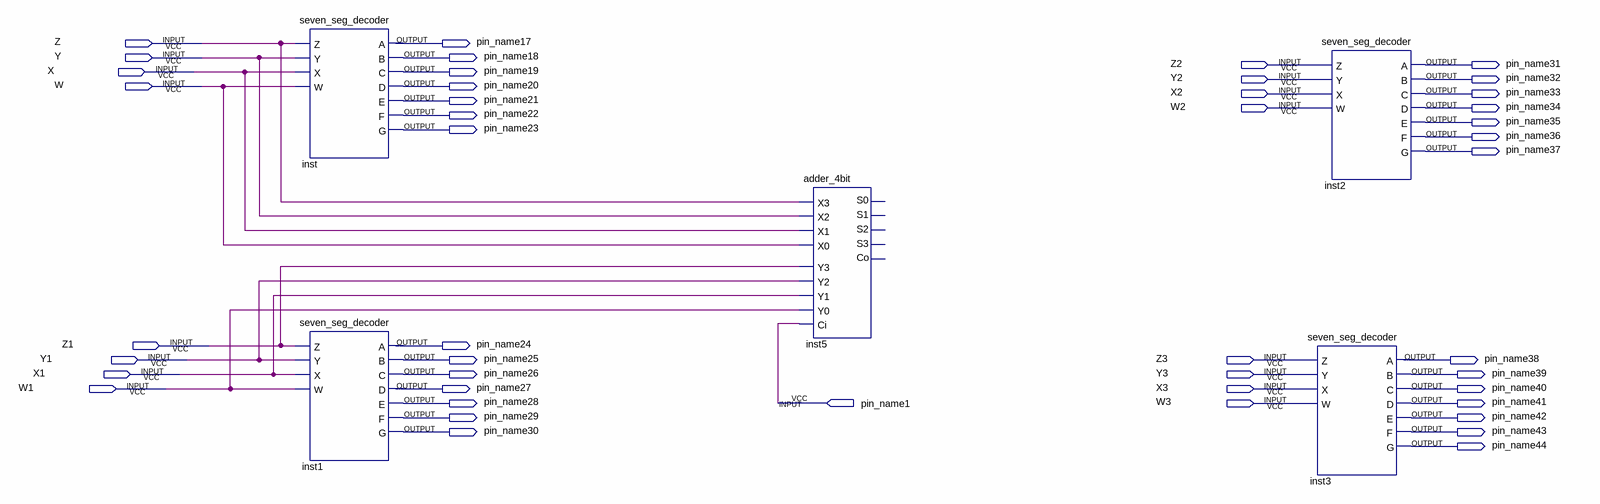
[diagram p0: schematic sheet]
// Quartus schematic Lab06step0.bdf as structural Verilog: 5 symbols, 45 pins
module Lab06step0 (
  input  Z,
  input  Y,
  input  Z2,
  input  X,
  input  Y2,
  input  W,
  input  X2,
  input  W2,
  input  Z1,
  input  Y1,
  input  Z3,
  input  X1,
  input  Y3,
  input  W1,
  input  X3,
  input  pin_name1,
  input  W3,
  output pin_name17,
  output pin_name18,
  output pin_name31,
  output pin_name19,
  output pin_name32,
  output pin_name20,
  output pin_name33,
  output pin_name21,
  output pin_name34,
  output pin_name22,
  output pin_name35,
  output pin_name23,
  output pin_name36,
  output pin_name37,
  output pin_name24,
  output pin_name25,
  output pin_name38,
  output pin_name26,
  output pin_name39,
  output pin_name27,
  output pin_name40,
  output pin_name28,
  output pin_name41,
  output pin_name29,
  output pin_name42,
  output pin_name30,
  output pin_name43,
  output pin_name44
);

  seven_seg_decoder inst (
    .Z(Z), .Y(Y), .X(X), .W(W), .B(pin_name18), .C(pin_name19), .D(pin_name20), .E(pin_name21),
    .F(pin_name22), .G(pin_name23));  // open: A
  seven_seg_decoder inst1 (
    .Z(Z1), .Y(Y1), .X(X1), .W(W1), .B(pin_name25), .C(pin_name26), .E(pin_name28), .F(pin_name29),
    .G(pin_name30));  // open: A, D
  adder_4bit inst5 (
    .X3(Z), .Y3(Z1), .X2(Y), .Y2(Y1), .X1(X), .Y1(X1), .X0(W), .Y0(W1), .Ci(pin_name1));  // open: S0, S1, S2, S3, Co
  seven_seg_decoder inst3 (
    .Z(Z3), .Y(Y3), .X(X3), .W(W3), .B(pin_name39), .C(pin_name40), .D(pin_name41), .E(pin_name42),
    .F(pin_name43), .G(pin_name44));  // open: A
  seven_seg_decoder inst2 (
    .Z(Z2), .Y(Y2), .X(X2), .W(W2), .A(pin_name31), .B(pin_name32), .C(pin_name33), .D(pin_name34),
    .E(pin_name35), .F(pin_name36), .G(pin_name37));
endmodule
